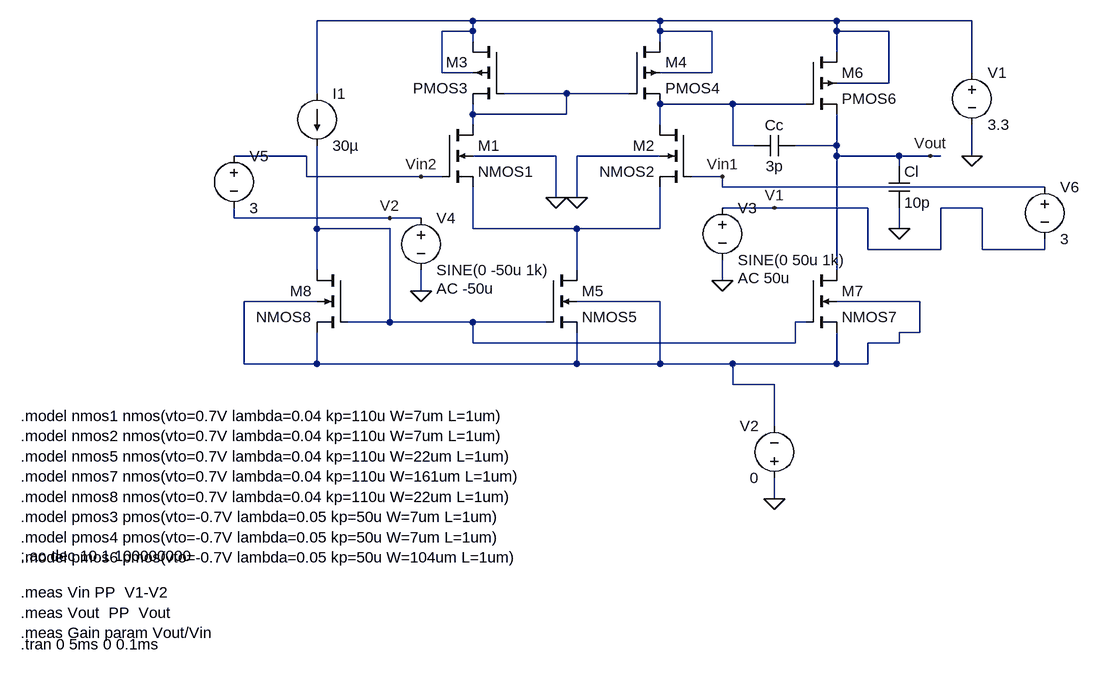
[diagram p0: schematic Two_stage_opamp.asc]
Two_stage_opamp.asc, the LTspice schematic file:
Version 4
SHEET 1 2200 960
WIRE 80 -16 -160 -16
WIRE 368 -16 80 -16
WIRE 640 -16 368 -16
WIRE 848 -16 640 -16
WIRE 80 0 80 -16
WIRE 80 0 32 0
WIRE 368 0 368 -16
WIRE 448 0 368 0
WIRE 640 0 640 -16
WIRE 720 0 640 0
WIRE 80 16 80 0
WIRE 368 16 368 0
WIRE 640 32 640 0
WIRE 32 64 32 0
WIRE 80 64 32 64
WIRE 448 64 448 0
WIRE 448 64 368 64
WIRE 848 64 848 -16
WIRE 720 80 720 0
WIRE 720 80 640 80
WIRE -160 96 -160 -16
WIRE 224 96 128 96
WIRE 320 96 224 96
WIRE 480 112 368 112
WIRE 592 112 480 112
WIRE 80 128 80 112
WIRE 224 128 224 96
WIRE 224 128 80 128
WIRE 80 144 80 128
WIRE 368 144 368 112
WIRE 480 176 480 112
WIRE 512 176 480 176
WIRE 640 176 640 128
WIRE 640 176 576 176
WIRE -176 192 -288 192
WIRE 208 192 80 192
WIRE 368 192 240 192
WIRE 640 192 640 176
WIRE 736 192 640 192
WIRE 784 192 736 192
WIRE 800 192 784 192
WIRE 848 192 848 144
WIRE 736 208 736 192
WIRE -176 224 -176 192
WIRE 0 224 -176 224
WIRE 32 224 0 224
WIRE 464 224 416 224
WIRE 464 240 464 224
WIRE 960 240 464 240
WIRE 208 256 208 192
WIRE 240 256 240 192
WIRE 544 272 464 272
WIRE 688 272 544 272
WIRE 864 272 800 272
WIRE -288 288 -288 272
WIRE -48 288 -288 288
WIRE 0 288 -48 288
WIRE -160 304 -160 176
WIRE -48 304 -160 304
WIRE 80 304 80 240
WIRE 240 304 80 304
WIRE 368 304 368 240
WIRE 368 304 240 304
WIRE 736 304 736 272
WIRE 688 336 688 272
WIRE 800 336 800 272
WIRE 800 336 688 336
WIRE 864 336 864 272
WIRE 960 336 960 320
WIRE 960 336 864 336
WIRE -160 368 -160 304
WIRE 240 368 240 304
WIRE 640 368 640 192
WIRE 464 384 464 352
WIRE 0 400 0 368
WIRE -160 416 -272 416
WIRE 368 416 240 416
WIRE 768 416 640 416
WIRE -48 448 -48 304
WIRE -48 448 -112 448
WIRE 80 448 -48 448
WIRE 192 448 80 448
WIRE 592 448 576 448
WIRE 768 464 768 416
WIRE 768 464 736 464
WIRE 80 480 80 448
WIRE 576 480 576 448
WIRE 576 480 80 480
WIRE 736 480 736 464
WIRE 736 480 688 480
WIRE -272 512 -272 416
WIRE -160 512 -160 464
WIRE -160 512 -272 512
WIRE 240 512 240 464
WIRE 240 512 -160 512
WIRE 368 512 368 416
WIRE 368 512 240 512
WIRE 480 512 368 512
WIRE 640 512 640 464
WIRE 640 512 480 512
WIRE 688 512 688 480
WIRE 688 512 640 512
WIRE 480 544 480 512
WIRE 544 544 480 544
WIRE 544 608 544 544
WIRE 544 720 544 688
FLAG 848 192 0
FLAG 736 304 0
FLAG 544 720 0
FLAG 784 192 Vout
FLAG 208 256 0
FLAG 240 256 0
FLAG 0 400 0
FLAG 464 384 0
FLAG 0 224 Vin2
FLAG 464 224 Vin1
FLAG -48 288 V2
FLAG 544 272 V1
SYMBOL nmos4 32 144 R0
SYMATTR InstName M1
SYMATTR Value NMOS1
SYMBOL nmos4 416 144 M0
SYMATTR InstName M2
SYMATTR Value NMOS2
SYMBOL nmos4 192 368 R0
SYMATTR InstName M5
SYMATTR Value NMOS5
SYMBOL nmos4 -112 368 M0
SYMATTR InstName M8
SYMATTR Value NMOS8
SYMBOL nmos4 592 368 R0
SYMATTR InstName M7
SYMATTR Value NMOS7
SYMBOL current -160 96 R0
WINDOW 123 0 0 Left 0
WINDOW 39 0 0 Left 0
SYMATTR InstName I1
SYMATTR Value 30µ
SYMBOL pmos4 128 16 M0
SYMATTR InstName M3
SYMATTR Value PMOS3
SYMBOL pmos4 320 16 R0
SYMATTR InstName M4
SYMATTR Value PMOS4
SYMBOL voltage 848 48 R0
WINDOW 123 0 0 Left 0
WINDOW 39 0 0 Left 0
SYMATTR InstName V1
SYMATTR Value 3.3
SYMBOL pmos4 592 32 R0
SYMATTR InstName M6
SYMATTR Value PMOS6
SYMBOL cap 576 160 R90
WINDOW 0 0 32 VBottom 2
WINDOW 3 32 32 VTop 2
SYMATTR InstName Cc
SYMATTR Value 3p
SYMBOL cap 720 208 R0
SYMATTR InstName Cl
SYMATTR Value 10p
SYMBOL voltage 544 704 R180
WINDOW 0 24 96 Left 2
WINDOW 3 24 16 Left 2
WINDOW 123 0 0 Left 0
WINDOW 39 0 0 Left 0
SYMATTR InstName V2
SYMATTR Value 0
SYMBOL voltage 464 256 R0
WINDOW 123 24 124 Left 2
WINDOW 39 0 0 Left 0
SYMATTR Value2 AC 50u
SYMATTR InstName V3
SYMATTR Value SINE(0 50u 1k)
SYMBOL voltage 0 272 R0
WINDOW 123 24 124 Left 2
WINDOW 39 0 0 Left 0
SYMATTR Value2 AC -50u
SYMATTR InstName V4
SYMATTR Value SINE(0 -50u 1k)
SYMBOL voltage -288 176 R0
WINDOW 123 0 0 Left 0
WINDOW 39 0 0 Left 0
SYMATTR InstName V5
SYMATTR Value 3
SYMBOL voltage 960 224 R0
WINDOW 123 0 0 Left 0
WINDOW 39 0 0 Left 0
SYMATTR InstName V6
SYMATTR Value 3
TEXT -616 592 Left 2 !.model nmos1 nmos(vto=0.7V lambda=0.04 kp=110u W=7um L=1um)\n.model nmos2 nmos(vto=0.7V lambda=0.04 kp=110u W=7um L=1um)\n.model nmos5 nmos(vto=0.7V lambda=0.04 kp=110u W=22um L=1um)\n.model nmos7 nmos(vto=0.7V lambda=0.04 kp=110u W=161um L=1um)\n.model nmos8 nmos(vto=0.7V lambda=0.04 kp=110u W=22um L=1um)\n.model pmos3 pmos(vto=-0.7V lambda=0.05 kp=50u W=7um L=1um)\n.model pmos4 pmos(vto=-0.7V lambda=0.05 kp=50u W=7um L=1um)\n.model pmos6 pmos(vto=-0.7V lambda=0.05 kp=50u W=104um L=1um)
TEXT -616 808 Left 2 !;.ac dec 10 1 100000000
TEXT -616 864 Left 2 !.meas Vin PP  V1-V2\n.meas Vout  PP  Vout\n.meas Gain param Vout/Vin
TEXT -616 944 Left 2 !.tran 0 5ms 0 0.1ms

The netlist it stands for:
* Two_stage_opamp.asc
M1 N002 Vin2 N005 0 NMOS1
M2 N003 Vin1 N005 0 NMOS2
M5 N005 N004 N006 N006 NMOS5
M8 N004 N004 N006 N006 NMOS8
M7 Vout N004 N006 N006 NMOS7
I1 N001 N004 30µ
M3 N001 N002 N002 N001 PMOS3
M4 N001 N002 N003 N001 PMOS4
V1 N001 0 3.3
M6 N001 N003 Vout N001 PMOS6
Cc Vout N003 3p
Cl Vout 0 10p
V2 0 N006 0
V3 V1 0 SINE(0 50u 1k) AC 50u
V4 V2 0 SINE(0 -50u 1k) AC -50u
V5 Vin2 V2 3
V6 Vin1 V1 3
.model NMOS NMOS
.model PMOS PMOS
.lib standard.mos
.model nmos1 nmos(vto=0.7V lambda=0.04 kp=110u W=7um L=1um)
.model nmos2 nmos(vto=0.7V lambda=0.04 kp=110u W=7um L=1um)
.model nmos5 nmos(vto=0.7V lambda=0.04 kp=110u W=22um L=1um)
.model nmos7 nmos(vto=0.7V lambda=0.04 kp=110u W=161um L=1um)
.model nmos8 nmos(vto=0.7V lambda=0.04 kp=110u W=22um L=1um)
.model pmos3 pmos(vto=-0.7V lambda=0.05 kp=50u W=7um L=1um)
.model pmos4 pmos(vto=-0.7V lambda=0.05 kp=50u W=7um L=1um)
.model pmos6 pmos(vto=-0.7V lambda=0.05 kp=50u W=104um L=1um)
;.ac dec 10 1 100000000
.meas Vin PP  V1-V2
.meas Vout  PP  Vout
.meas Gain param Vout/Vin
.tran 0 5ms 0 0.1ms
.backanno
.end